# Altium project Altium-TableTennisX4_Receiver.PrjPcb
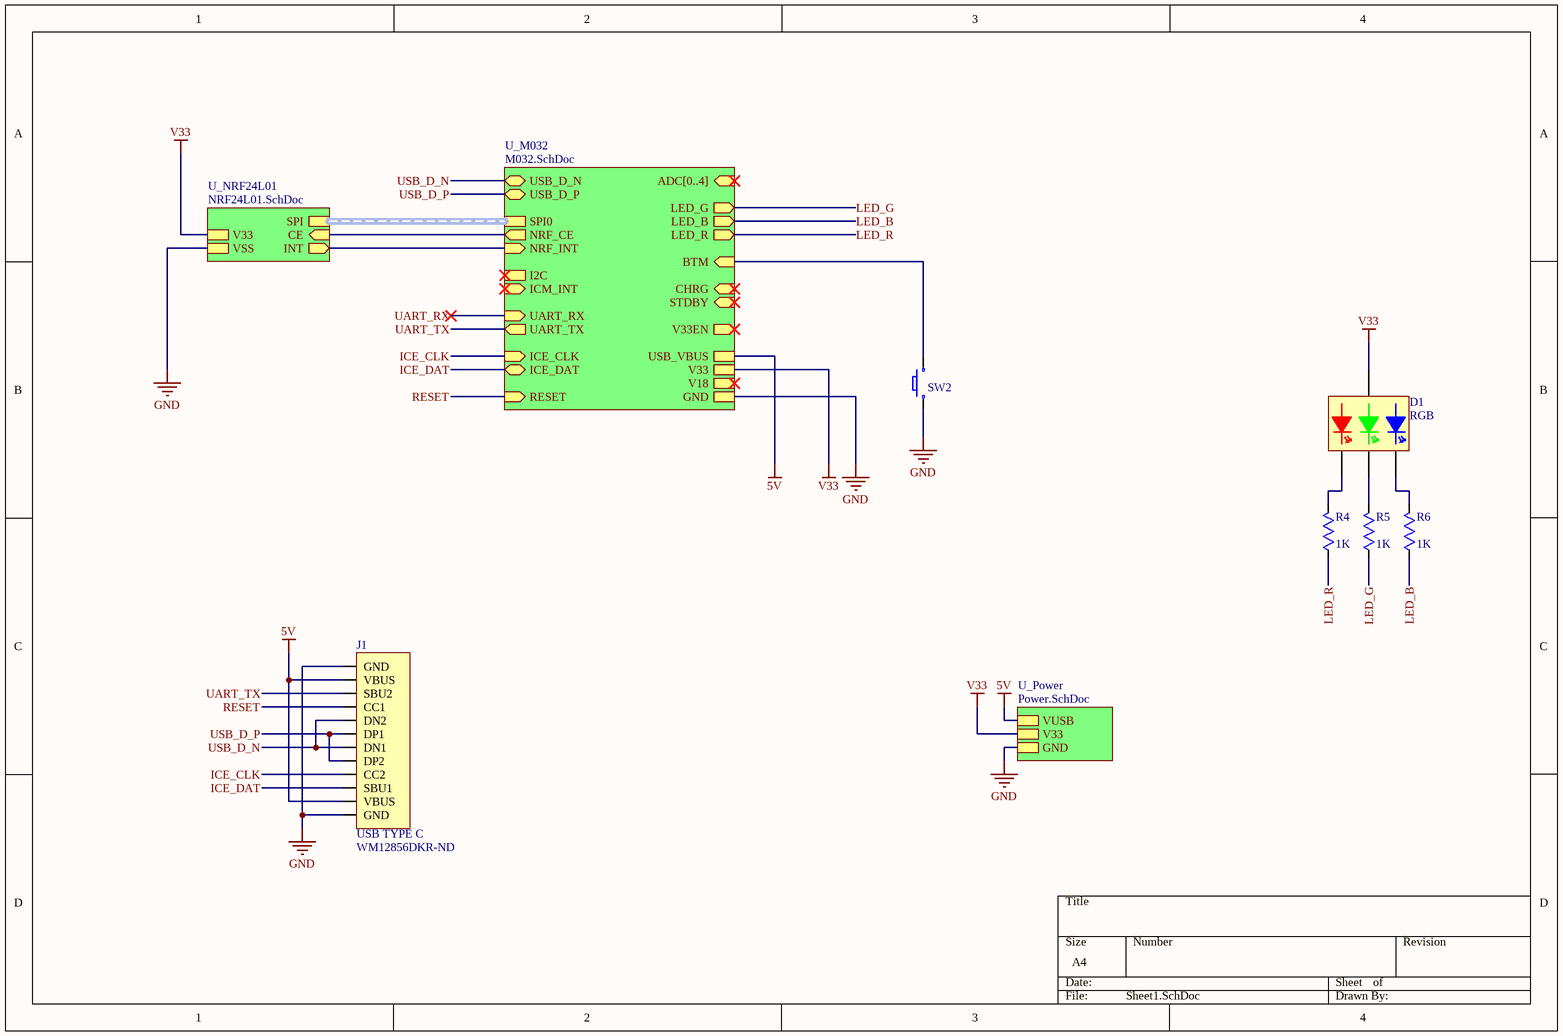
[diagram p0: Sheet1.SchDoc]
4 sheets, 25 parts. Net scope: hierarchical (ports join the sheet entries above them; power ports are global).
Board files: PCB1.PcbDoc, PCB2.PcbDoc
Sheets:
  Sheet1.SchDoc
    U_M032 = M032.SchDoc
    U_NRF24L01 = NRF24L01.SchDoc
    U_Power = Power.SchDoc

## Sheet Sheet1.SchDoc
size A4; SheetNumber: 1; SheetTotal: 4

### Parts
D1  RGB  [1411_LED]
J1  USB TYPE C  Supplier Part Number 1: WM12856DKR-ND  [USBC-SMD16F]
R4  value 1K  [RES_0402]  (hidden comment: Res)
R5  value 1K  [RES_0402]  (hidden comment: Res)
R6  value 1K  [RES_0402]  (hidden comment: Res)
SW2  SPST  [TACK-SW_SMD 2P 4x3mm_2]  (value not drawn)

### Sub-sheets
U_M032 = M032.SchDoc: ADC[0..4] (in), LED_R (out), LED_G (out), LED_B (out), BTM (in), V33EN (out), CHRG (in), STDBY (in), USB_D_P (bidir), USB_D_N (bidir), NRF_INT (in), ICM_INT (in), SPI0 (harness SPI), I2C (harness I2C), UART_TX (out), UART_RX (in), ICE_CLK (in), ICE_DAT (bidir), RESET (in), V33, V18, GND, NRF_CE (out), USB_VBUS
U_NRF24L01 = NRF24L01.SchDoc: SPI (harness SPI), V33, VSS, INT (out), CE (in)
U_Power = Power.SchDoc: V33, GND, VUSB

### Nets
5V: J1.2(VBUS) J1.11(VBUS) ; sheet U_M032/USB_VBUS, sheet U_Power/VUSB  [project net USB_VBUS]
GND: J1.1(GND) J1.12(GND) SW2.2 ; sheet U_M032/GND, sheet U_NRF24L01/VSS, sheet U_Power/GND
V33: D1.1(Anode) ; sheet U_M032/V33, sheet U_NRF24L01/V33, sheet U_Power/V33  [project net MCU_VDD]
CE: sheet U_M032/NRF_CE, sheet U_NRF24L01/CE
ICE_CLK: J1.9(CC2) ; sheet U_M032/ICE_CLK  [project net FP1_ICE_CLK]
ICE_DAT: J1.10(SBU1) ; sheet U_M032/ICE_DAT  [project net FP0_ICE_DAT]
INT: sheet U_M032/NRF_INT, sheet U_NRF24L01/INT
LED_B: R6.2 ; sheet U_M032/LED_B
LED_G: R5.2 ; sheet U_M032/LED_G
LED_R: R4.2 ; sheet U_M032/LED_R
PA9_IO_BTM: SW2.1 ; sheet U_M032/BTM
RESET: J1.4(CC1) ; sheet U_M032/RESET  [project net nRESET]
UART_TX: J1.3(SBU2) ; sheet U_M032/UART_TX  [project net PA1_UART0_TXD]
USB_D_N: J1.5(DN2) J1.7(DN1) ; sheet U_M032/USB_D_N
USB_D_P: J1.6(DP1) J1.8(DP2) ; sheet U_M032/USB_D_P
NetD1_2: D1.2(B) R6.1
NetD1_3: D1.3(R) R4.1
NetD1_4: D1.4(G) R5.1

### Buses and harness runs
harness sheet U_M032/SPI0 = sheet U_NRF24L01/SPI

### Library data of the parts
D1 = LED_1411
J1 = USB TYPE C: USB Shielded I/O Receptacle; Type C; Right Angle; Surface Mount; Gold over Nickel; Manufacturer: Molex; Manufacturer Part Number: 105450-0101; Number of Contacts: 24; Current Rating: 5A; Mating Cycles: 10000; USB Standard: USB 3.1; Number of Ports: 1; Pitch: 0.5mm; Supplier 1: Digi-Key; RoHS: Yes; Category: Connectors; Stock 1: 21711; Pricing 1: 1=2.15000, 10=1.94900, 25=1.82960, 50=1.75000, 100=1.67050, 250=1.51140, 500=1.39208 (USD); Mount: Surface Mount,Through Hole,Horizontal; Case/Package: 0101; Number of Pins: 24; Contact Plating: Gold; Contact Material: Copper Alloy; Housing Material: Thermoplastic; Insulation Color: Black; Number of Terminals: 24; Min Operating Temperature: -30°C; Max Operating Temperature: 85°C; Packaging: Tape and Reel; Gender: Receptacle; Connector Type: USB; Orientation: Right Angle; Termination: Solder; Shielding: Shielded; Features: Shielded; Length: 8.94mm; REACH SVHC: Unknown; Flammability Rating: UL94 V-0; ComponentLink1URL: http://www.farnell.com/datasheets/2801634.pdf?src-supplier=Farnell; ComponentLink1Description: http://www.farnell.com/datasheets/2801634.pdf?src-supplier=Farnell; ComponentLink2URL: http://www.farnell.com/datasheets/2672741.pdf?src-supplier=Newark; ComponentLink2Description: http://www.farnell.com/datasheets/2672741.pdf?src-supplier=Newark; ComponentLink3URL: http://www.farnell.com/datasheets/2015275.pdf?src-supplier=Element14; ComponentLink3Description: http://www.farnell.com/datasheets/2015275.pdf?src-supplier=Element14; ComponentLink4URL: https://www.molex.com/pdm_docs/ps/PS-105448-001.pdf?src-supplier=Digi-Key; ComponentLink4Description: https://www.molex.com/pdm_docs/ps/PS-105448-001.pdf?src-supplier=Digi-Key; ComponentLink5URL: http://www.farnell.com/datasheets/2801634.pdf?src-supplier=Newark; ComponentLink5Description: http://www.farnell.com/datasheets/2801634.pdf?src-supplier=Newark; ComponentLink6URL: https://www.molex.com/pdm_docs/sd/1054500101_sd.pdf?src-supplier=Digi-Key; ComponentLink6Description: https://www.molex.com/pdm_docs/sd/1054500101_sd.pdf?src-supplier=Digi-Key; ComponentLink7URL: http://www.farnell.com/datasheets/2801634.pdf?src-supplier=Element14; ComponentLink7Description: http://www.farnell.com/datasheets/2801634.pdf?src-supplier=Element14; ComponentLink8URL: http://www.literature.molex.com/SQLImages/kelmscott/Molex/PDF_Images/987651-4081.PDF?src-supplier=Avnet; ComponentLink8Description: http://www.literature.molex.com/SQLImages/kelmscott/Molex/PDF_Images/987651-4081.PDF?src-supplier=Avnet; ComponentLink9URL: http://www.literature.molex.com/SQLImages/kelmscott/Molex/PDF_Images/987651-4081.PDF?src-supplier=Avnet+Asia; ComponentLink9Description: http://www.literature.molex.com/SQLImages/kelmscott/Molex/PDF_Images/987651-4081.PDF?src-supplier=Avnet+Asia
SW2 = Switch_Button1

## Sheet M032.SchDoc
size A4; SheetNumber: 3; SheetTotal: 4
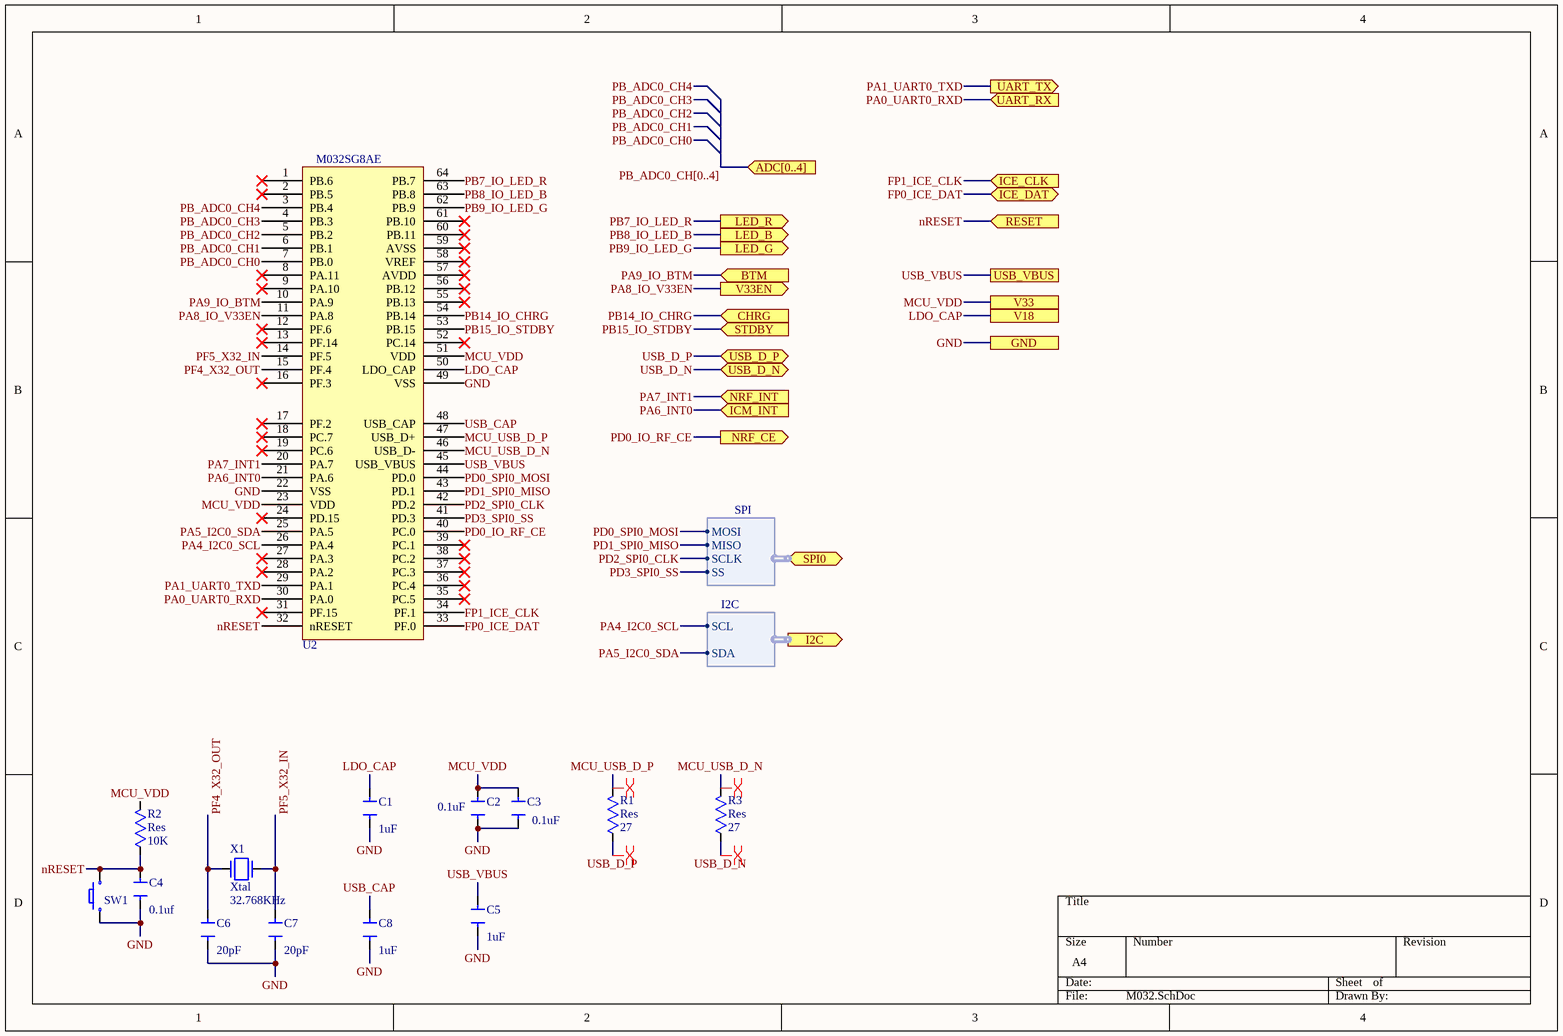
[diagram p1: M032.SchDoc]

### Parts
C1  value 1uF  [CAP_0402]  (hidden comment: Cap)
C2  value 0.1uF  [CAP_0402]  (hidden comment: Cap)
C3  value 0.1uF  [CAP_0402]  (hidden comment: Cap)
C4  value 0.1uf  [CAP_0402]  (hidden comment: Cap)
C5  value 1uF  [CAP_0402]  (hidden comment: Cap)
C6  value 20pF  [CAP_0402]  (hidden comment: Cap)
C7  value 20pF  [CAP_0402]  (hidden comment: Cap)
C8  value 1uF  [CAP_0402]  (hidden comment: Cap)
R1  Res  value 27  [RES_0402]
R2  Res  value 10K  [RES_0402]
R3  Res  value 27  [RES_0402]
SW1  SPST  [TACK-SW_SMD 2P 4x3mm_2]  (value not drawn)
U2  M032SG8AE  [MCU_LQFP_64_7x7]
X1  Xtal  value 32.768KHz  [X3215]

### Ports
ADC[0..4] (in), BTM (in), CHRG (in), GND, I2C (out, harness I2C), ICE_CLK (in), ICE_DAT (bidir), ICM_INT (in), LED_B (out), LED_G (out), LED_R (out), NRF_CE (out), NRF_INT (in), RESET (in), SPI0 (bidir, harness SPI), STDBY (in), UART_RX (in), UART_TX (out), USB_D_N (bidir), USB_D_P (bidir), USB_VBUS, V18, V33, V33EN (out)

### Harnesses
SPI: SS, SCLK, MISO, MOSI
I2C: SCL, SDA

### Nets
GND: C1.2 C2.2 C3.2 C4.2 C5.2 C6.2 C7.2 C8.2 SW1.2 U2.22(VSS) U2.49(VSS) ; port GND
MCU_VDD: C2.1 C3.1 R2.1 U2.23(VDD) U2.51(VDD) ; port V33
USB_VBUS: C5.1 U2.45(USB_VBUS) ; port USB_VBUS
FP0_ICE_DAT: U2.33(PF.0) ; port ICE_DAT
FP1_ICE_CLK: U2.34(PF.1) ; port ICE_CLK
LDO_CAP: C1.1 U2.50(LDO_CAP) ; port V18
MCU_USB_D_N: R3.1 U2.46(USB_D-)
MCU_USB_D_P: R1.1 U2.47(USB_D+)
nRESET: C4.1 R2.2 SW1.1 U2.32(nRESET) ; port RESET
PA0_UART0_RXD: U2.30(PA.0) ; port UART_RX
PA1_UART0_TXD: U2.29(PA.1) ; port UART_TX
PA4_I2C0_SCL: U2.26(PA.4) ; port I2C.SCL
PA5_I2C0_SDA: U2.25(PA.5) ; port I2C.SDA
PA6_INT0: U2.21(PA.6) ; port ICM_INT
PA7_INT1: U2.20(PA.7) ; port NRF_INT  [project net INT]
PA8_IO_V33EN: U2.11(PA.8) ; port V33EN
PA9_IO_BTM: U2.10(PA.9) ; port BTM
PB7_IO_LED_R: U2.64(PB.7) ; port LED_R  [project net LED_R]
PB8_IO_LED_B: U2.63(PB.8) ; port LED_B  [project net LED_B]
PB9_IO_LED_G: U2.62(PB.9) ; port LED_G  [project net LED_G]
PB14_IO_CHRG: U2.54(PB.14) ; port CHRG
PB15_IO_STDBY: U2.53(PB.15) ; port STDBY
PB_ADC0_CH0: U2.7(PB.0)
PB_ADC0_CH1: U2.6(PB.1)
PB_ADC0_CH2: U2.5(PB.2)
PB_ADC0_CH3: U2.4(PB.3)
PB_ADC0_CH4: U2.3(PB.4)
PD0_IO_RF_CE: U2.40(PC.0) ; port NRF_CE  [project net CE]
PD0_SPI0_MOSI: U2.44(PD.0) ; port SPI0.MOSI
PD1_SPI0_MISO: U2.43(PD.1) ; port SPI0.MISO
PD2_SPI0_CLK: U2.42(PD.2) ; port SPI0.SCLK
PD3_SPI0_SS: U2.41(PD.3) ; port SPI0.SS
PF4_X32_OUT: C6.1 U2.15(PF.4) X1.2
PF5_X32_IN: C7.1 U2.14(PF.5) X1.1
USB_CAP: C8.1 U2.48(USB_CAP)
USB_D_N: R3.2 ; port USB_D_N
USB_D_P: R1.2 ; port USB_D_P

Not connected (* = marked no-connect by the designer): U2 1(PB.6)* 2(PB.5)* 8(PA.11)* 9(PA.10)* 12(PF.6)* 13(PF.14)* 16(PF.3)* 17(PF.2)* 18(PC.7)* 19(PC.6)* 24(PD.15)* 27(PA.3)* 28(PA.2)* 31(PF.15)* 35(PC.5)* 36(PC.4)* 37(PC.3)* 38(PC.2)* 39(PC.1)* 52(PC.14)* 55(PB.13)* 56(PB.12)* 57(AVDD)* 58(VREF)* 59(AVSS)* 60(PB.11)* 61(PB.10)*

### Buses and harness runs
bus PB_ADC0_CH[0..4] = port ADC[0..4]

### Layout directives
differential pair: MCU_USB_D_N, MCU_USB_D_P, USB_D_N, USB_D_P

### Library data of the parts
SW1 = Switch_Button1

## Sheet NRF24L01.SchDoc
size A4; SheetNumber: 2; SheetTotal: 3
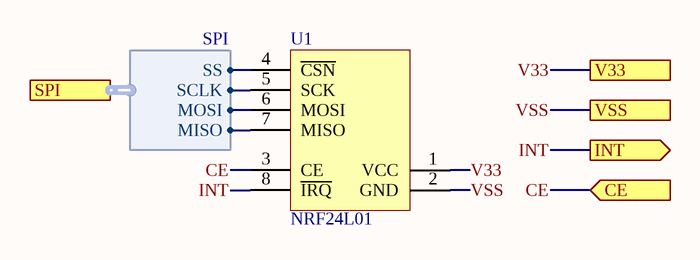
[diagram p2: NRF24L01.SchDoc]

### Parts
U1  NRF24L01  [NRF24L01P+PA+LNA+IPX]

### Ports
CE (in), INT (out), SPI (harness SPI), V33, VSS

### Harnesses
SPI: SS, SCLK, MOSI, MISO

### Nets
V33: U1.1(VCC) ; port V33  [project net MCU_VDD]
VSS: U1.2(GND) ; port VSS  [project net GND]
CE: U1.3(CE) ; port CE
INT: U1.8(~{IRQ}) ; port INT
PD0_SPI0_MOSI: U1.6(MOSI) ; port SPI.MOSI
PD1_SPI0_MISO: U1.7(MISO) ; port SPI.MISO
PD2_SPI0_CLK: U1.5(SCK) ; port SPI.SCLK
PD3_SPI0_SS: U1.4(~{CSN}) ; port SPI.SS

### Library data of the parts
U1 = NRF24L01_module: pin to pad: 2>8 3>2 4>3 5>4 6>5 7>6 8>7

## Sheet Power.SchDoc
size A4; SheetNumber: 4; SheetTotal: 4
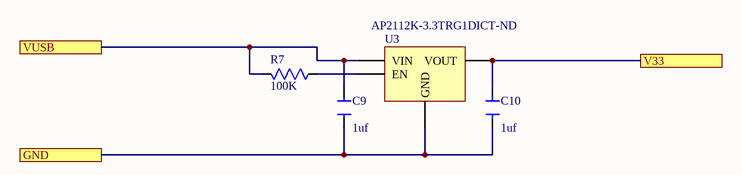
[diagram p3: Power.SchDoc]

### Parts
C9  value 1uf  [CAP_0402]  (hidden comment: Cap)
C10  value 1uf  [CAP_0402]  (hidden comment: Cap)
R7  value 100K  [RES_0402]  (hidden comment: Res)
U3  Supplier Part Number 1: AP2112K-3.3TRG1DICT-ND  [SOT23-5]  (hidden comment: AP2112K-3.3TRG1)

### Ports
GND, V33, VUSB

### Nets
GND: C9.2 C10.2 U3.3(GND) ; port GND
MCU_VDD: C10.1 U3.4(VOUT) ; port V33
USB_VBUS: C9.1 R7.1 U3.1(VIN) ; port VUSB
NetR7_2: R7.2 U3.2(EN)

### Library data of the parts
U3 = AP2112K-3.3TRG1: IC REG LINEAR 3.3V 600MA SOT23-5; pin to pad: 2>3 3>2 4>5; Manufacturer: Diodes; Number of Regulators: 1; Quiescent Current: 55uA; Polarity: Positive; Max Input Voltage: 6V; Min Input Voltage: 2.5V; Accuracy: 1.5%; Dropout Voltage: 250mV; Output Type: Fixed; Supplier 1: Digi-Key; Manufacturer Part Number: AP2112K-3.3TRG1; RoHS: Yes; Category: Voltage Regulators - Linear; Stock 1: 54786; Pricing 1: 1=0.47000, 10=0.35500, 25=0.32000, 100=0.17450, 250=0.16872, 500=0.15126, 1000=0.11636 (USD); Mount: Surface Mount; Case/Package: SOT-23-5; Number of Pins: 5; Min Operating Temperature: -40°C; Max Operating Temperature: 85°C; Output Current: 600mA; Max Output Current: 600mA; Output Voltage: 3.3V; Number of Outputs: 1; Package Quantity: 1; Packaging: Tape and Reel; Length: 3.1mm; Height: 1.3mm; Width: 1.7mm; Lead Free: Lead Free; ComponentLink1URL: https://datasheet.ciiva.com/29569/ap2112-29569919.pdf?src-supplier=Digi-Key; ComponentLink1Description: https://datasheet.ciiva.com/29569/ap2112-29569919.pdf?src-supplier=Digi-Key; ComponentLink2URL: https://datasheet.ciiva.com/30016/ap2112-30016792.pdf?src-supplier=Avnet; ComponentLink2Description: https://datasheet.ciiva.com/30016/ap2112-30016792.pdf?src-supplier=Avnet; ComponentLink3URL: https://datasheet.ciiva.com/29569/ap2112-29569917.pdf?src-supplier=Digi-Key; ComponentLink3Description: https://datasheet.ciiva.com/29569/ap2112-29569917.pdf?src-supplier=Digi-Key; ComponentLink4URL: https://datasheet.ciiva.com/29569/ap2112-29569918.pdf?src-supplier=Digi-Key; ComponentLink4Description: https://datasheet.ciiva.com/29569/ap2112-29569918.pdf?src-supplier=Digi-Key

## Nets that join several sheets
GND: Sheet1 (J1.1 J1.12 SW2.2), M032 (11 pins), NRF24L01 (U1.2), Power (C9.2 C10.2 U3.3)
MCU_VDD: Sheet1 (D1.1), M032 (5 pins), NRF24L01 (U1.1), Power (C10.1 U3.4)
USB_VBUS: Sheet1 (J1.2 J1.11), M032 (C5.1 U2.45), Power (C9.1 R7.1 U3.1)
CE: M032 (U2.40), NRF24L01 (U1.3)
FP0_ICE_DAT: Sheet1 (J1.10), M032 (U2.33)
FP1_ICE_CLK: Sheet1 (J1.9), M032 (U2.34)
INT: M032 (U2.20), NRF24L01 (U1.8)
LED_B: Sheet1 (R6.2), M032 (U2.63)
LED_G: Sheet1 (R5.2), M032 (U2.62)
LED_R: Sheet1 (R4.2), M032 (U2.64)
nRESET: Sheet1 (J1.4), M032 (C4.1 R2.2 SW1.1 U2.32)
PA1_UART0_TXD: Sheet1 (J1.3), M032 (U2.29)
PA9_IO_BTM: Sheet1 (SW2.1), M032 (U2.10)
PD0_SPI0_MOSI: M032 (U2.44), NRF24L01 (U1.6)
PD1_SPI0_MISO: M032 (U2.43), NRF24L01 (U1.7)
PD2_SPI0_CLK: M032 (U2.42), NRF24L01 (U1.5)
PD3_SPI0_SS: M032 (U2.41), NRF24L01 (U1.4)
USB_D_N: Sheet1 (J1.5 J1.7), M032 (R3.2)
USB_D_P: Sheet1 (J1.6 J1.8), M032 (R1.2)